# Altium schematic sheet MK_0 (4).SchDoc
size 420 x 297 mm; Address1: Address1; Address2: Address2; Address3: Address3; Address4: Address4; DocumentNumber: MK_0 (4); SheetNumber: 3; Scale: 1:1; DocumentType: Схема электрическая принципиальная
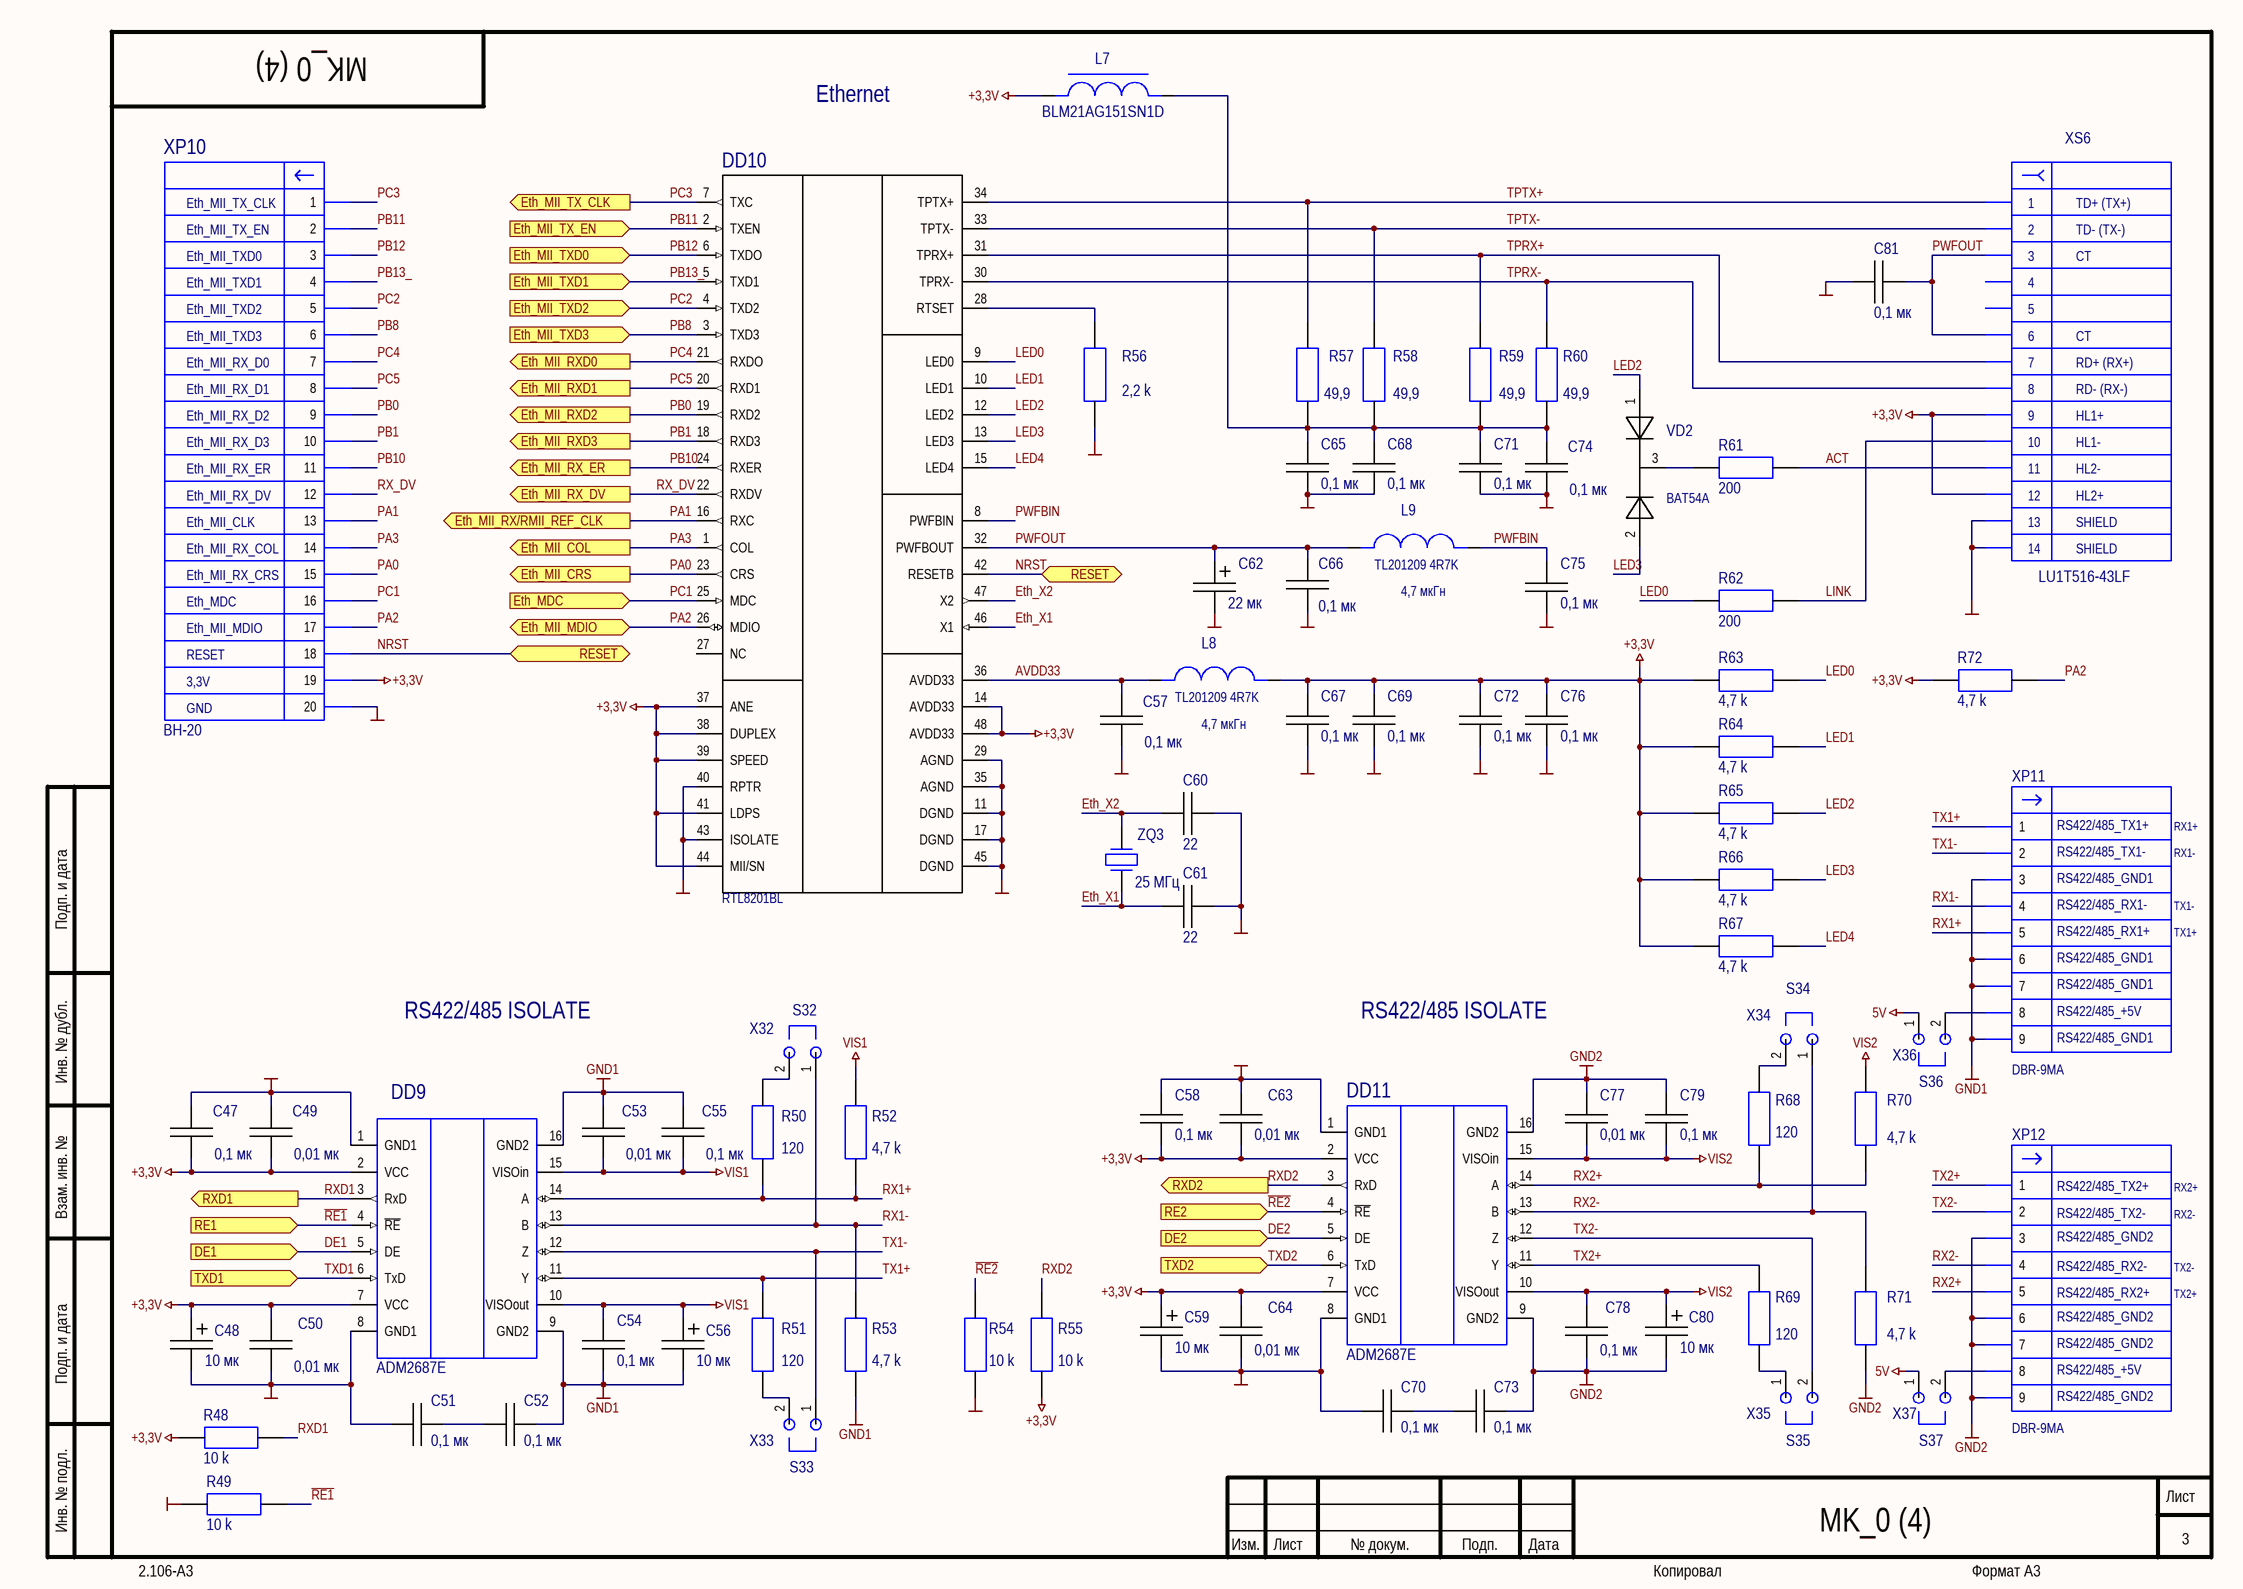
[diagram p0: MK_0 (4).SchDoc]

## Parts
C47  0,1 мк  [CAPC_1206]
C48  10 мк  [3216]
C49  0,01 мк  [CAPC_1206]
C50  0,01 мк  [CAPC_1206]
C51  0,1 мк  [CAPC_1206]
C52  0,1 мк  [CAPC_1206]
C53  0,01 мк  [CAPC_1206]
C54  0,1 мк  [CAPC_1206]
C55  0,1 мк  [CAPC_1206]
C56  10 мк  [3216]
C57  0,1 мк  [CAPC_1206]
C58  0,1 мк  [CAPC_1206]
C59  10 мк  [3216]
C60  22  [CAPC_1206]
C61  22  [CAPC_1206]
C62  22 мк  [3216]
C63  0,01 мк  [CAPC_1206]
C64  0,01 мк  [CAPC_1206]
C65  0,1 мк  [CAPC_1206]
C66  0,1 мк  [CAPC_1206]
C67  0,1 мк  [CAPC_1206]
C68  0,1 мк  [CAPC_1206]
C69  0,1 мк  [CAPC_1206]
C70  0,1 мк  [CAPC_1206]
C71  0,1 мк  [CAPC_1206]
C72  0,1 мк  [CAPC_1206]
C73  0,1 мк  [CAPC_1206]
C74  0,1 мк  [CAPC_1206]
C75  0,1 мк  [CAPC_1206]
C76  0,1 мк  [CAPC_1206]
C77  0,01 мк  [CAPC_1206]
C78  0,1 мк  [CAPC_1206]
C79  0,1 мк  [CAPC_1206]
C80  10 мк  [3216]
C81  0,1 мк  [CAPC_1206]
DD9  ADM2687E  [SOIC_IC16]
DD10  RTL8201BL  [SQFP48]
DD11  ADM2687E  [SOIC_IC16]
L7  BLM21AG151SN1D  [C0805]
L8  TL201209 4R7K  Value1: 4,7 мкГн  [C0805]
L9  TL201209 4R7K  Value1: 4,7 мкГн  [C0805]
R48  10 k  [SMD_1206]
R49  10 k  [SMD_1206]
R50  120  [SMD_1206]
R51  120  [SMD_1206]
R52  4,7 k  [SMD_1206]
R53  4,7 k  [SMD_1206]
R54  10 k  [SMD_1206]
R55  10 k  [SMD_1206]
R56  2,2 k  [SMD_1206]
R57  49,9  [SMD_1206]
R58  49,9  [SMD_1206]
R59  49,9  [SMD_1206]
R60  49,9  [SMD_1206]
R61  200  [SMD_1206]
R62  200  [SMD_1206]
R63  4,7 k  [SMD_1206]
R64  4,7 k  [SMD_1206]
R65  4,7 k  [SMD_1206]
R66  4,7 k  [SMD_1206]
R67  4,7 k  [SMD_1206]
R68  120  [SMD_1206]
R69  120  [SMD_1206]
R70  4,7 k  [SMD_1206]
R71  4,7 k  [SMD_1206]
R72  4,7 k  [SMD_1206]
VD2  BAT54A  [SOT23]
X32  Jamper: S32  [PLS-2]  (hidden comment: PLS-02)
X33  Jamper: S33  [PLS-2]  (hidden comment: PLS-02)
X34  Jamper: S34  [PLS-2]  (hidden comment: PLS-02)
X35  Jamper: S35  [PLS-2]  (hidden comment: PLS-02)
X36  Jamper: S36  [PLS-2]  (hidden comment: PLS-02)
X37  Jamper: S37  [PLS-2]  (hidden comment: PLS-02)
XP10  BH-20  [PLD-20]
XP11  DBR-9MA  [DB9M]
XP12  DBR-9MA  [DB9M]
XS6  LU1T516-43LF  [LU1T516-43LF]
ZQ3  25 МГц  [HC-49U_5mm]

## Ports
DE1 (in), DE2 (in), Eth_MDC (in), Eth_MII_COL (out), Eth_MII_CRS (out), Eth_MII_MDIO (bidir), Eth_MII_RX/RMII_REF_CLK (out), Eth_MII_RX_DV (out), Eth_MII_RX_ER (out), Eth_MII_RXD0 (out), Eth_MII_RXD1 (out), Eth_MII_RXD2 (out), Eth_MII_RXD3 (out), Eth_MII_TX_CLK (out), Eth_MII_TX_EN (in), Eth_MII_TXD0 (in), Eth_MII_TXD1 (in), Eth_MII_TXD2 (in), Eth_MII_TXD3 (in), RE1 (in), RE2 (in), RESET (bidir), RXD1 (out), RXD2 (out), TXD1 (in), TXD2 (in)

## Nets
5V: X36.1 X37.1
+3,3V: C47.1 C48.1(+) C49.1 C50.2 C58.1 C59.1(+) C63.1 C64.2 C67.2 C69.2 C72.2 C76.2 DD9.2(VCC) DD9.7(VCC) DD10.14(AVDD33) DD10.37(ANE) DD10.38(DUPLEX) DD10.39(SPEED) DD10.41(LDPS) DD10.44(MII/SN) DD10.48(AVDD33) DD11.2(VCC) DD11.7(VCC) L7.1 L8.2 R48.1 R55.1 R63.1 R64.1 R65.1 R66.1 R67.1 R72.2 XP10.19 XS6.9 XS6.12
GND: C47.2 C48.2(-) C49.2 C50.1 C51.2 C57.1 C58.2 C59.2(-) C60.1 C61.1 C62.2(-) C63.2 C64.1 C65.1 C66.1 C67.1 C68.1 C69.1 C70.2 C71.1 C72.1 C74.1 C75.1 C76.1 C81.2 DD9.1(GND1) DD9.8(GND1) DD10.11(DGND) DD10.17(DGND) DD10.29(AGND) DD10.35(AGND) DD10.40(RPTR) DD10.43(ISOLATE) DD10.45(DGND) DD11.1(GND1) DD11.8(GND1) R49.1 R54.1 R56.1 XP10.20 XS6.13 XS6.14
GND1: C52.1 C53.2 C54.1 C55.2 C56.2(-) DD9.9(GND2) DD9.16(GND2) R53.2 XP11.3 XP11.6 XP11.7 XP11.9
GND2: C73.1 C77.2 C78.1 C79.2 C80.2(-) DD11.9(GND2) DD11.16(GND2) R71.2 XP12.3 XP12.6 XP12.7 XP12.9
VIS1: C53.1 C54.2 C55.1 C56.1(+) DD9.10(VISOout) DD9.15(VISOin) R52.2
VIS2: C77.1 C78.2 C79.1 C80.1(+) DD11.10(VISOout) DD11.15(VISOin) R70.2
~{RE1}: DD9.4(~{RE}) R49.2 ; port RE1
~{RE2}: DD11.4(~{RE}) R54.2 ; port RE2
ACT: R61.1 XS6.11
AVDD33: C57.2 DD10.36(AVDD33) L8.1
DE1: DD9.5(DE) ; port DE1
DE2: DD11.5(DE) ; port DE2
Eth_X1: C61.2 DD10.46(X1) ZQ3.1
Eth_X2: C60.2 DD10.47(X2) ZQ3.2
LED0: DD10.9(LED0) R62.2 R63.2
LED1: DD10.10(LED1) R64.2
LED2: DD10.12(LED2) R65.2 VD2.1(+)
LED3: DD10.13(LED3) R66.2 VD2.2(-)
LED4: DD10.15(LED4) R67.2
LINK: R62.1 XS6.10
NRST: DD10.42(RESETB) XP10.18 ; port RESET
PA0: DD10.23(CRS) XP10.15 ; port Eth_MII_CRS
PA1: DD10.16(RXC) XP10.13 ; port Eth_MII_RX/RMII_REF_CLK
PA2: DD10.26(MDIO) R72.1 XP10.17 ; port Eth_MII_MDIO
PA3: DD10.1(COL) XP10.14 ; port Eth_MII_COL
PB0: DD10.19(RXD2) XP10.9 ; port Eth_MII_RXD2
PB1: DD10.18(RXD3) XP10.10 ; port Eth_MII_RXD3
PB8: DD10.3(TXD3) XP10.6 ; port Eth_MII_TXD3
PB10: DD10.24(RXER) XP10.11 ; port Eth_MII_RX_ER
PB11: DD10.2(TXEN) XP10.2 ; port Eth_MII_TX_EN
PB12: DD10.6(TXDO) XP10.3 ; port Eth_MII_TXD0
PB13_: DD10.5(TXD1) XP10.4 ; port Eth_MII_TXD1
PC1: DD10.25(MDC) XP10.16 ; port Eth_MDC
PC2: DD10.4(TXD2) XP10.5 ; port Eth_MII_TXD2
PC3: DD10.7(TXC) XP10.1 ; port Eth_MII_TX_CLK
PC4: DD10.21(RXDO) XP10.7 ; port Eth_MII_RXD0
PC5: DD10.20(RXD1) XP10.8 ; port Eth_MII_RXD1
PWFBIN: C75.2 DD10.8(PWFBIN) L9.2
PWFOUT: C62.1(+) C66.2 C81.1 DD10.32(PWFBOUT) L9.1 XS6.3 XS6.6
RX1+: DD9.14(A) R50.2 R52.1 XP11.5
RX1-: DD9.13(B) R53.1 X32.1 XP11.4
RX2+: DD11.14(A) R68.2 R70.1 XP12.5
RX2-: DD11.13(B) R71.1 X34.1 XP12.4
RX_DV: DD10.22(RXDV) XP10.12 ; port Eth_MII_RX_DV
RXD1: DD9.3(RxD) R48.2 ; port RXD1
RXD2: DD11.3(RxD) R55.2 ; port RXD2
TPRX+: DD10.31(TPRX+) R59.2 XS6.7
TPRX-: DD10.30(TPRX-) R60.2 XS6.8
TPTX+: DD10.34(TPTX+) R57.2 XS6.1
TPTX-: DD10.33(TPTX-) R58.2 XS6.2
TX1+: DD9.11(Y) R51.1 XP11.1
TX1-: DD9.12(Z) X33.1 XP11.2
TX2+: DD11.11(Y) R69.1 XP12.1
TX2-: DD11.12(Z) X35.2 XP12.2
TXD1: DD9.6(TxD) ; port TXD1
TXD2: DD11.6(TxD) ; port TXD2
NetC51_1: C51.1 C52.2
NetC65_2: C65.2 C68.2 C71.2 C74.2 L7.2 R57.1 R58.1 R59.1 R60.1
NetC70_1: C70.1 C73.2
NetDD10_28: DD10.28(RTSET) R56.2
NetR50_1: R50.1 X32.2
NetR51_2: R51.2 X33.2
NetR61_2: R61.2 VD2.3
NetR68_1: R68.1 X34.2
NetR69_2: R69.2 X35.1
NetX36_2: X36.2 XP11.8
NetX37_2: X37.2 XP12.8

Not connected (* = marked no-connect by the designer): DD10 27(NC); XS6 4 5

## Notes on the sheet
- Ethernet
- (near XP10) Eth_MII_TX_CLK
- (near XP10) Eth_MII_TX_EN
- (near XP10) Eth_MII_TXD0
- (near XP10) Eth_MII_TXD1
- (near XP10) Eth_MII_TXD2
- (near XP10) Eth_MII_RX_D0
- (near XP10) Eth_MII_RX_D1
- (near XP10) Eth_MII_TXD3
- (near XP10) Eth_MII_RX_D2
- (near XP10) Eth_MII_RX_D3
- (near XP10) Eth_MII_RX_DV
- Eth_MII_CLK
- (near XP10) Eth_MII_RX_ER
- (near XP10) Eth_MII_RX_COL
- (near XP10) Eth_MII_RX_CRS
- Eth_MDC
- (near XP10) Eth_MII_MDIO
- RESET
- GND
- 3,3V
- (near XP11) RS422/485_TX1+
- (near XP11) RS422/485_TX1-
- RX1+
- RX1-
- (near XP11) RS422/485_RX1-
- (near XP11) RS422/485_RX1+
- (near XP11) RS422/485_GND1
- TX1+
- TX1-
- RS422/485 ISOLATE
- (near XP11) RS422/485_+5V
- (near XP12) RS422/485_TX2+
- RX2+
- (near XP12) RS422/485_RX2-
- (near XP12) RS422/485_TX2-
- (near XP12) RS422/485_GND2
- TX2-
- RX2-
- (near XP12) RS422/485_RX2+
- TX2+
- (near XP12) RS422/485_+5V
- Подп. и дата
- Инв. № дубл.
- Взам. инв. №
- Инв. № подл.
- Изм.
- Лист
- № докум.
- Подп.
- Дата
- 2.106-A3
- Копировал
- Формат А3
- (in symbol RJ45) TD+ (TX+); TD- (TX-); CT; RD+ (RX+); RD- (RX-); HL1+; HL1-; HL2-; HL2+; SHIELD

## Library data of the parts
C47 C49-C55 C57 C58 C60 C61 C63-C79 C81 = C: Capasitor; MarkPCB: *; Name: *
  C47 C51 C52 C54 C55 C57 C58 C65-C76 C78 C79 C81: ValueSCH: 0,1 мк; Part Number: C; Component Kind: Standard; Component Type: Standard; Designator: C; Footprint: K73-17; Pin Count: 2
  C49 C50 C53 C63 C64 C77: ValueSCH: 0,01 мк; Part Number: C; Component Kind: Standard; Component Type: Standard; Designator: C; Footprint: K73-17; Pin Count: 2
  C60 C61: ValueSCH: 22
C48 C56 C59 C62 C80 = CapPol: Capasitor_polar; Part Number: CapPol; Component Kind: Standard; Component Type: Standard; Designator: CapPol; Footprint: CapPolar; Pin Count: 2
  C48 C56 C59 C80: ValueSCH: 10 мк
  C62: ValueSCH: 22 мк
DD9 DD11 = ADM2682E: RS422/RS485 transceivier 15 kV ESD Protection; Firma: Analog Devices; Mark: ADM2687E; Mark1: ADM2682E
DD10 = RTL8201BL: Ethernet phyciever, 10/100M; Firma: Realtek; Mark: RTL8201BL
L7 = B: Ferrite bead; Value: BLM21AG151SN1D; datasheet: *
L8 = L: Inductance; firma: TEXSTAR; Value: TL201209 4R7K
L9 = L: Inductance; Firma: TEXSTAR; Value: TL201209 4R7K
R48-R72 = R_Gost: Resistor,2 Pin; ValueBOM: *; MarkPCB: *
  R48 R49 R54 R55: ValueSCH: 10 k
  R50 R51 R68 R69: ValueSCH: 120
  R52 R53 R63-R67 R70-R72: ValueSCH: 4,7 k
  R56: ValueSCH: 2,2 k
  R57-R60: ValueSCH: 49,9
  R61 R62: ValueSCH: 200
VD2 = BS40-06: Diod Schottky, 3 pin; Manufacturer: Fairchild; Mark: BS40-06; ComponentLink1Description: Параметры; ComponentLink2Description: Сайт производителя; ComponentLink1URL: D\datasheet\BAT54.pdf; ComponentLink2URL: *; ManufacturerPartNumber: BAT54A; Power\Voltage: *; Rem: *; TKE: *; Tolerance: *; TU/GOST: *; Value: *; Примечание: *
X32-X37 = J2: Value: PLS-02
XP11 XP12 = X9: Manufacturer: Ningbo; ComponentLink1Description: Параметры; ComponentLink2Description: Сайт производителя; ComponentLink2URL: *; ManufacturerPartNumber: DBR-9MA; Power\Voltage: *; Rem: *; TKE: *; Tolerance: *; TU/GOST: *; Value: *; Примечание: *
XS6 = RJ45: Value1: SK02-111006NL; Firma: WIZNET; Firma1: RoHS; Value: LU1T516-43LF
ZQ3 = OSC: Value: 25 МГц
XP10 = BH-20: Value: BH-20